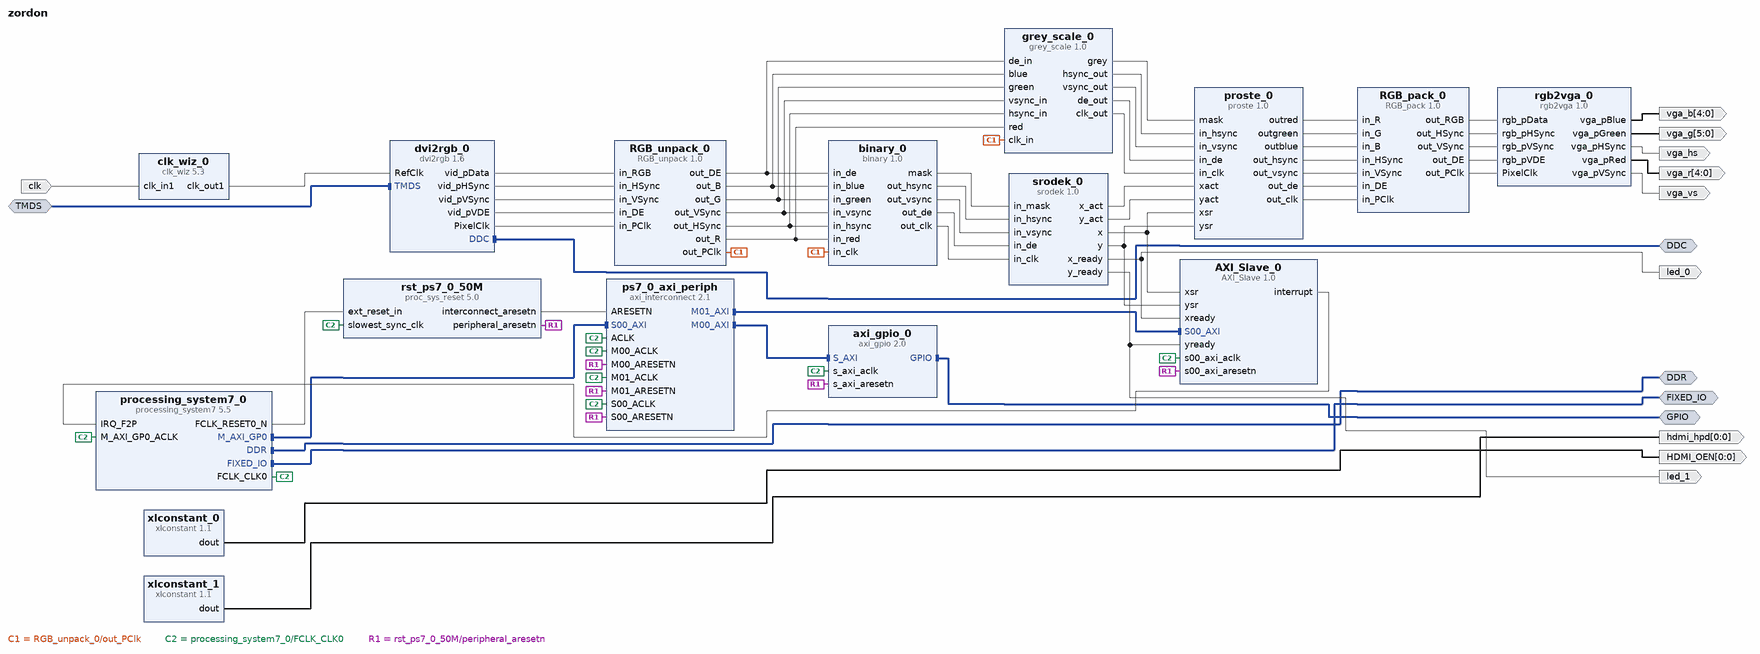
[diagram p0: block diagram of the top level]
# Vivado block design zordon, xc7z010clg400-1, Vivado 2016.3
create_bd_design zordon

create_bd_intf_port -mode Master -vlnv xilinx.com:interface:iic_rtl:1.0 DDC
create_bd_intf_port -mode Slave -vlnv digilentinc.com:interface:tmds_rtl:1.0 TMDS
create_bd_intf_port -mode Master -vlnv xilinx.com:interface:ddrx_rtl:1.0 DDR
create_bd_intf_port -mode Master -vlnv xilinx.com:display_processing_system7:fixedio_rtl:1.0 FIXED_IO
create_bd_intf_port -mode Master -vlnv xilinx.com:interface:gpio_rtl:1.0 GPIO
create_bd_port -dir O -from 4 -to 0 vga_r
create_bd_port -dir O -from 5 -to 0 vga_g
create_bd_port -dir O -from 4 -to 0 vga_b
create_bd_port -dir O vga_hs
create_bd_port -dir O vga_vs
create_bd_port -dir O -from 0 -to 0 HDMI_OEN
create_bd_port -dir O -from 0 -to 0 hdmi_hpd
create_bd_port -dir I -type clk clk
set_property -dict {CONFIG.FREQ_HZ 125000000 CONFIG.CLK_DOMAIN zordon_processing_system7_0_0_FCLK_CLK1} [get_bd_ports clk]
create_bd_port -dir O led_0
create_bd_port -dir O led_1

create_bd_cell -type ip -vlnv digilentinc.com:ip:rgb2vga:1.0 rgb2vga_0
create_bd_cell -type ip -vlnv xilinx.com:ip:xlconstant:1.1 xlconstant_0
set_property -dict {CONFIG.CONST_VAL 0} [get_bd_cells xlconstant_0]
create_bd_cell -type ip -vlnv xilinx.com:ip:xlconstant:1.1 xlconstant_1
set_property -dict {CONFIG.CONST_VAL 1} [get_bd_cells xlconstant_1]
create_bd_cell -type ip -vlnv digilentinc.com:ip:dvi2rgb:1.6 dvi2rgb_0
set_property -dict [list \
  CONFIG.kRstActiveHigh false \
  CONFIG.kClkRange 1 \
  CONFIG.kAddBUFG false \
  CONFIG.kEdidFileName 720p_edid.txt \
] [get_bd_cells dvi2rgb_0]
create_bd_cell -type ip -vlnv xilinx.com:ip:clk_wiz:5.3 clk_wiz_0
set_property -dict [list \
  CONFIG.PRIMITIVE PLL \
  CONFIG.PRIM_IN_FREQ 125 \
  CONFIG.CLKIN1_JITTER_PS 80.0 \
  CONFIG.CLKOUT2_USED false \
  CONFIG.CLKOUT3_USED false \
  CONFIG.NUM_OUT_CLKS 1 \
  CONFIG.CLKOUT1_REQUESTED_OUT_FREQ 200 \
  CONFIG.CLKOUT3_REQUESTED_OUT_FREQ 150 \
  CONFIG.PRIM_SOURCE Single_ended_clock_capable_pin \
  CONFIG.CLKOUT1_DRIVES BUFG \
  CONFIG.CLKOUT2_DRIVES BUFG \
  CONFIG.CLKOUT3_DRIVES BUFG \
  CONFIG.CLKOUT4_DRIVES BUFG \
  CONFIG.CLKOUT5_DRIVES BUFG \
  CONFIG.CLKOUT6_DRIVES BUFG \
  CONFIG.CLKOUT7_DRIVES BUFG \
  CONFIG.OVERRIDE_MMCM false \
  CONFIG.MMCM_DIVCLK_DIVIDE 1 \
  CONFIG.MMCM_CLKFBOUT_MULT_F 8 \
  CONFIG.MMCM_CLKIN1_PERIOD 8.0 \
  CONFIG.MMCM_COMPENSATION ZHOLD \
  CONFIG.MMCM_CLKOUT0_DIVIDE_F 5 \
  CONFIG.MMCM_CLKOUT1_DIVIDE 1 \
  CONFIG.MMCM_CLKOUT2_DIVIDE 1 \
  CONFIG.CLKOUT1_JITTER 109.241 \
  CONFIG.CLKOUT1_PHASE_ERROR 96.948 \
  CONFIG.CLKOUT2_JITTER 124.615 \
  CONFIG.CLKOUT2_PHASE_ERROR 96.948 \
  CONFIG.CLKOUT3_JITTER 168.006 \
  CONFIG.CLKOUT3_PHASE_ERROR 222.305 \
] [get_bd_cells clk_wiz_0]
create_bd_cell -type ip -vlnv xilinx.com:ip:RGB_unpack:1.0 RGB_unpack_0
create_bd_cell -type ip -vlnv xilinx.com:ip:RGB_pack:1.0 RGB_pack_0
create_bd_cell -type ip -vlnv xilinx.com:user:srodek:1.0 srodek_0
create_bd_cell -type ip -vlnv xilinx.com:user:binary:1.0 binary_0
set_property -dict {CONFIG.LOW_R 0 CONFIG.HIGH_R 30 CONFIG.LOW_G 40 CONFIG.HIGH_G 255 CONFIG.HIGH_B 30} [get_bd_cells binary_0]
create_bd_cell -type ip -vlnv xilinx.com:user:proste:1.0 proste_0
create_bd_cell -type ip -vlnv xilinx.com:ip:processing_system7:5.5 processing_system7_0
set_property -dict [list \
  CONFIG.PCW_UIPARAM_DDR_FREQ_MHZ 525 \
  CONFIG.PCW_CRYSTAL_PERIPHERAL_FREQMHZ 50 \
  CONFIG.PCW_APU_PERIPHERAL_FREQMHZ 650 \
  CONFIG.PCW_FPGA0_PERIPHERAL_FREQMHZ 100 \
  CONFIG.PCW_USE_FABRIC_INTERRUPT 1 \
  CONFIG.PCW_IRQ_F2P_INTR 1 \
  CONFIG.PCW_PRESET_BANK1_VOLTAGE {LVCMOS 1.8V} \
  CONFIG.PCW_UART0_PERIPHERAL_ENABLE 1 \
  CONFIG.PCW_UART0_UART0_IO {MIO 14 .. 15} \
  CONFIG.PCW_UART1_PERIPHERAL_ENABLE 1 \
  CONFIG.PCW_GPIO_MIO_GPIO_ENABLE 0 \
] [get_bd_cells processing_system7_0]
# 5 more settings of processing_system7_0 are not shown: defaults, MIO pin electricals, DDR timing, and values the tool derives
create_bd_cell -type ip -vlnv xilinx.com:ip:axi_gpio:2.0 axi_gpio_0
set_property -dict {CONFIG.C_GPIO_WIDTH 4 CONFIG.C_ALL_INPUTS 1} [get_bd_cells axi_gpio_0]
create_bd_cell -type ip -vlnv xilinx.com:ip:axi_interconnect:2.1 ps7_0_axi_periph
set_property -dict {CONFIG.NUM_MI 2} [get_bd_cells ps7_0_axi_periph]
create_bd_cell -type ip -vlnv xilinx.com:ip:proc_sys_reset:5.0 rst_ps7_0_50M
create_bd_cell -type ip -vlnv xilinx.com:user:AXI_Slave:1.0 AXI_Slave_0
create_bd_cell -type ip -vlnv xilinx.com:user:grey_scale:1.0 grey_scale_0

# ---- connections ----

connect_bd_intf_net [get_bd_intf_pins processing_system7_0/M_AXI_GP0] [get_bd_intf_pins ps7_0_axi_periph/S00_AXI]
connect_bd_intf_net [get_bd_intf_pins ps7_0_axi_periph/M00_AXI] [get_bd_intf_pins axi_gpio_0/S_AXI]
connect_bd_intf_net [get_bd_intf_pins ps7_0_axi_periph/M01_AXI] [get_bd_intf_pins AXI_Slave_0/S00_AXI]
connect_bd_intf_net [get_bd_intf_ports DDC] [get_bd_intf_pins dvi2rgb_0/DDC]
connect_bd_intf_net [get_bd_intf_ports TMDS] [get_bd_intf_pins dvi2rgb_0/TMDS]
connect_bd_intf_net [get_bd_intf_ports DDR] [get_bd_intf_pins processing_system7_0/DDR]
connect_bd_intf_net [get_bd_intf_ports FIXED_IO] [get_bd_intf_pins processing_system7_0/FIXED_IO]
connect_bd_intf_net [get_bd_intf_ports GPIO] [get_bd_intf_pins axi_gpio_0/GPIO]
connect_bd_net [get_bd_pins rgb2vga_0/vga_pRed] [get_bd_ports vga_r]
connect_bd_net [get_bd_pins rgb2vga_0/vga_pGreen] [get_bd_ports vga_g]
connect_bd_net [get_bd_pins rgb2vga_0/vga_pBlue] [get_bd_ports vga_b]
connect_bd_net [get_bd_pins rgb2vga_0/vga_pHSync] [get_bd_ports vga_hs]
connect_bd_net [get_bd_pins rgb2vga_0/vga_pVSync] [get_bd_ports vga_vs]
connect_bd_net [get_bd_pins xlconstant_0/dout] [get_bd_ports HDMI_OEN]
connect_bd_net [get_bd_pins xlconstant_1/dout] [get_bd_ports hdmi_hpd]
connect_bd_net [get_bd_ports clk] [get_bd_pins clk_wiz_0/clk_in1]
connect_bd_net [get_bd_pins clk_wiz_0/clk_out1] [get_bd_pins dvi2rgb_0/RefClk]
connect_bd_net [get_bd_pins dvi2rgb_0/vid_pData] [get_bd_pins RGB_unpack_0/in_RGB]
connect_bd_net [get_bd_pins dvi2rgb_0/vid_pHSync] [get_bd_pins RGB_unpack_0/in_HSync]
connect_bd_net [get_bd_pins dvi2rgb_0/vid_pVSync] [get_bd_pins RGB_unpack_0/in_VSync]
connect_bd_net [get_bd_pins dvi2rgb_0/vid_pVDE] [get_bd_pins RGB_unpack_0/in_DE]
connect_bd_net [get_bd_pins dvi2rgb_0/PixelClk] [get_bd_pins RGB_unpack_0/in_PClk]
connect_bd_net [get_bd_pins RGB_pack_0/out_RGB] [get_bd_pins rgb2vga_0/rgb_pData]
connect_bd_net [get_bd_pins RGB_pack_0/out_HSync] [get_bd_pins rgb2vga_0/rgb_pHSync]
connect_bd_net [get_bd_pins RGB_pack_0/out_VSync] [get_bd_pins rgb2vga_0/rgb_pVSync]
connect_bd_net [get_bd_pins RGB_pack_0/out_DE] [get_bd_pins rgb2vga_0/rgb_pVDE]
connect_bd_net [get_bd_pins RGB_pack_0/out_PClk] [get_bd_pins rgb2vga_0/PixelClk]
connect_bd_net [get_bd_pins srodek_0/x] [get_bd_pins proste_0/xsr] [get_bd_pins AXI_Slave_0/xsr]
connect_bd_net [get_bd_pins srodek_0/y] [get_bd_pins proste_0/ysr] [get_bd_pins AXI_Slave_0/ysr]
connect_bd_net [get_bd_pins srodek_0/x_act] [get_bd_pins proste_0/xact]
connect_bd_net [get_bd_pins srodek_0/y_act] [get_bd_pins proste_0/yact]
connect_bd_net [get_bd_pins proste_0/outred] [get_bd_pins RGB_pack_0/in_R]
connect_bd_net [get_bd_pins proste_0/outgreen] [get_bd_pins RGB_pack_0/in_G]
connect_bd_net [get_bd_pins proste_0/outblue] [get_bd_pins RGB_pack_0/in_B]
connect_bd_net [get_bd_pins proste_0/out_hsync] [get_bd_pins RGB_pack_0/in_HSync]
connect_bd_net [get_bd_pins proste_0/out_vsync] [get_bd_pins RGB_pack_0/in_VSync]
connect_bd_net [get_bd_pins proste_0/out_de] [get_bd_pins RGB_pack_0/in_DE]
connect_bd_net [get_bd_pins proste_0/out_clk] [get_bd_pins RGB_pack_0/in_PClk]
connect_bd_net [get_bd_pins srodek_0/x_ready] [get_bd_ports led_0] [get_bd_pins AXI_Slave_0/xready]
connect_bd_net [get_bd_pins srodek_0/y_ready] [get_bd_ports led_1] [get_bd_pins AXI_Slave_0/yready]
connect_bd_net [get_bd_pins RGB_unpack_0/out_DE] [get_bd_pins binary_0/in_de] [get_bd_pins grey_scale_0/de_in]
connect_bd_net [get_bd_pins RGB_unpack_0/out_B] [get_bd_pins binary_0/in_blue] [get_bd_pins grey_scale_0/blue]
connect_bd_net [get_bd_pins RGB_unpack_0/out_PClk] [get_bd_pins binary_0/in_clk] [get_bd_pins grey_scale_0/clk_in]
connect_bd_net [get_bd_pins RGB_unpack_0/out_G] [get_bd_pins binary_0/in_green] [get_bd_pins grey_scale_0/green]
connect_bd_net [get_bd_pins RGB_unpack_0/out_VSync] [get_bd_pins binary_0/in_vsync] [get_bd_pins grey_scale_0/vsync_in]
connect_bd_net [get_bd_pins RGB_unpack_0/out_HSync] [get_bd_pins binary_0/in_hsync] [get_bd_pins grey_scale_0/hsync_in]
connect_bd_net [get_bd_pins RGB_unpack_0/out_R] [get_bd_pins binary_0/in_red] [get_bd_pins grey_scale_0/red]
connect_bd_net [get_bd_pins binary_0/mask] [get_bd_pins srodek_0/in_mask]
connect_bd_net [get_bd_pins binary_0/out_hsync] [get_bd_pins srodek_0/in_hsync]
connect_bd_net [get_bd_pins binary_0/out_vsync] [get_bd_pins srodek_0/in_vsync]
connect_bd_net [get_bd_pins binary_0/out_de] [get_bd_pins srodek_0/in_de]
connect_bd_net [get_bd_pins binary_0/out_clk] [get_bd_pins srodek_0/in_clk]
connect_bd_net [get_bd_pins processing_system7_0/FCLK_CLK0] \
  [get_bd_pins processing_system7_0/M_AXI_GP0_ACLK] [get_bd_pins rst_ps7_0_50M/slowest_sync_clk] \
  [get_bd_pins axi_gpio_0/s_axi_aclk] [get_bd_pins AXI_Slave_0/s00_axi_aclk] [get_bd_pins ps7_0_axi_periph/S00_ACLK] \
  [get_bd_pins ps7_0_axi_periph/ACLK] [get_bd_pins ps7_0_axi_periph/M00_ACLK] [get_bd_pins ps7_0_axi_periph/M01_ACLK]
connect_bd_net [get_bd_pins processing_system7_0/FCLK_RESET0_N] [get_bd_pins rst_ps7_0_50M/ext_reset_in]
connect_bd_net [get_bd_pins rst_ps7_0_50M/peripheral_aresetn] \
  [get_bd_pins axi_gpio_0/s_axi_aresetn] [get_bd_pins AXI_Slave_0/s00_axi_aresetn] [get_bd_pins ps7_0_axi_periph/S00_ARESETN] \
  [get_bd_pins ps7_0_axi_periph/M00_ARESETN] [get_bd_pins ps7_0_axi_periph/M01_ARESETN]
connect_bd_net [get_bd_pins rst_ps7_0_50M/interconnect_aresetn] [get_bd_pins ps7_0_axi_periph/ARESETN]
connect_bd_net [get_bd_pins AXI_Slave_0/interrupt] [get_bd_pins processing_system7_0/IRQ_F2P]
connect_bd_net [get_bd_pins grey_scale_0/grey] [get_bd_pins proste_0/mask]
connect_bd_net [get_bd_pins grey_scale_0/hsync_out] [get_bd_pins proste_0/in_hsync]
connect_bd_net [get_bd_pins grey_scale_0/vsync_out] [get_bd_pins proste_0/in_vsync]
connect_bd_net [get_bd_pins grey_scale_0/de_out] [get_bd_pins proste_0/in_de]
connect_bd_net [get_bd_pins grey_scale_0/clk_out] [get_bd_pins proste_0/in_clk]

# ---- address map ----
assign_bd_address -offset 0x41200000 -range 64K -target_address_space [get_bd_addr_spaces processing_system7_0/Data] [get_bd_addr_segs axi_gpio_0/S_AXI/Reg]
assign_bd_address -offset 0x43C00000 -range 64K -target_address_space [get_bd_addr_spaces processing_system7_0/Data] [get_bd_addr_segs AXI_Slave_0/S00_AXI/S00_AXI_reg]

validate_bd_design
save_bd_design
